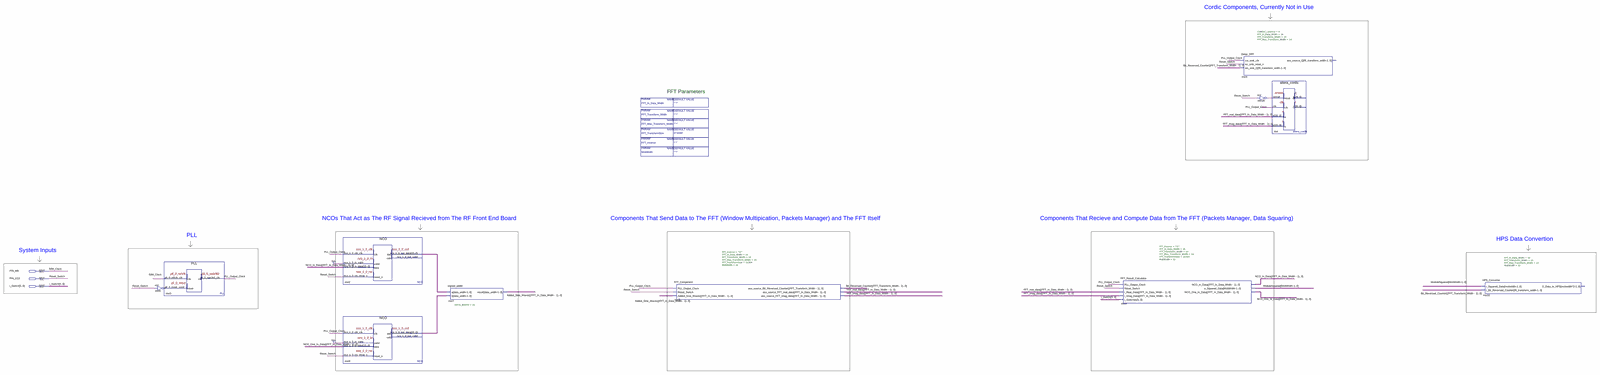
[diagram p0: schematic sheet, whole]
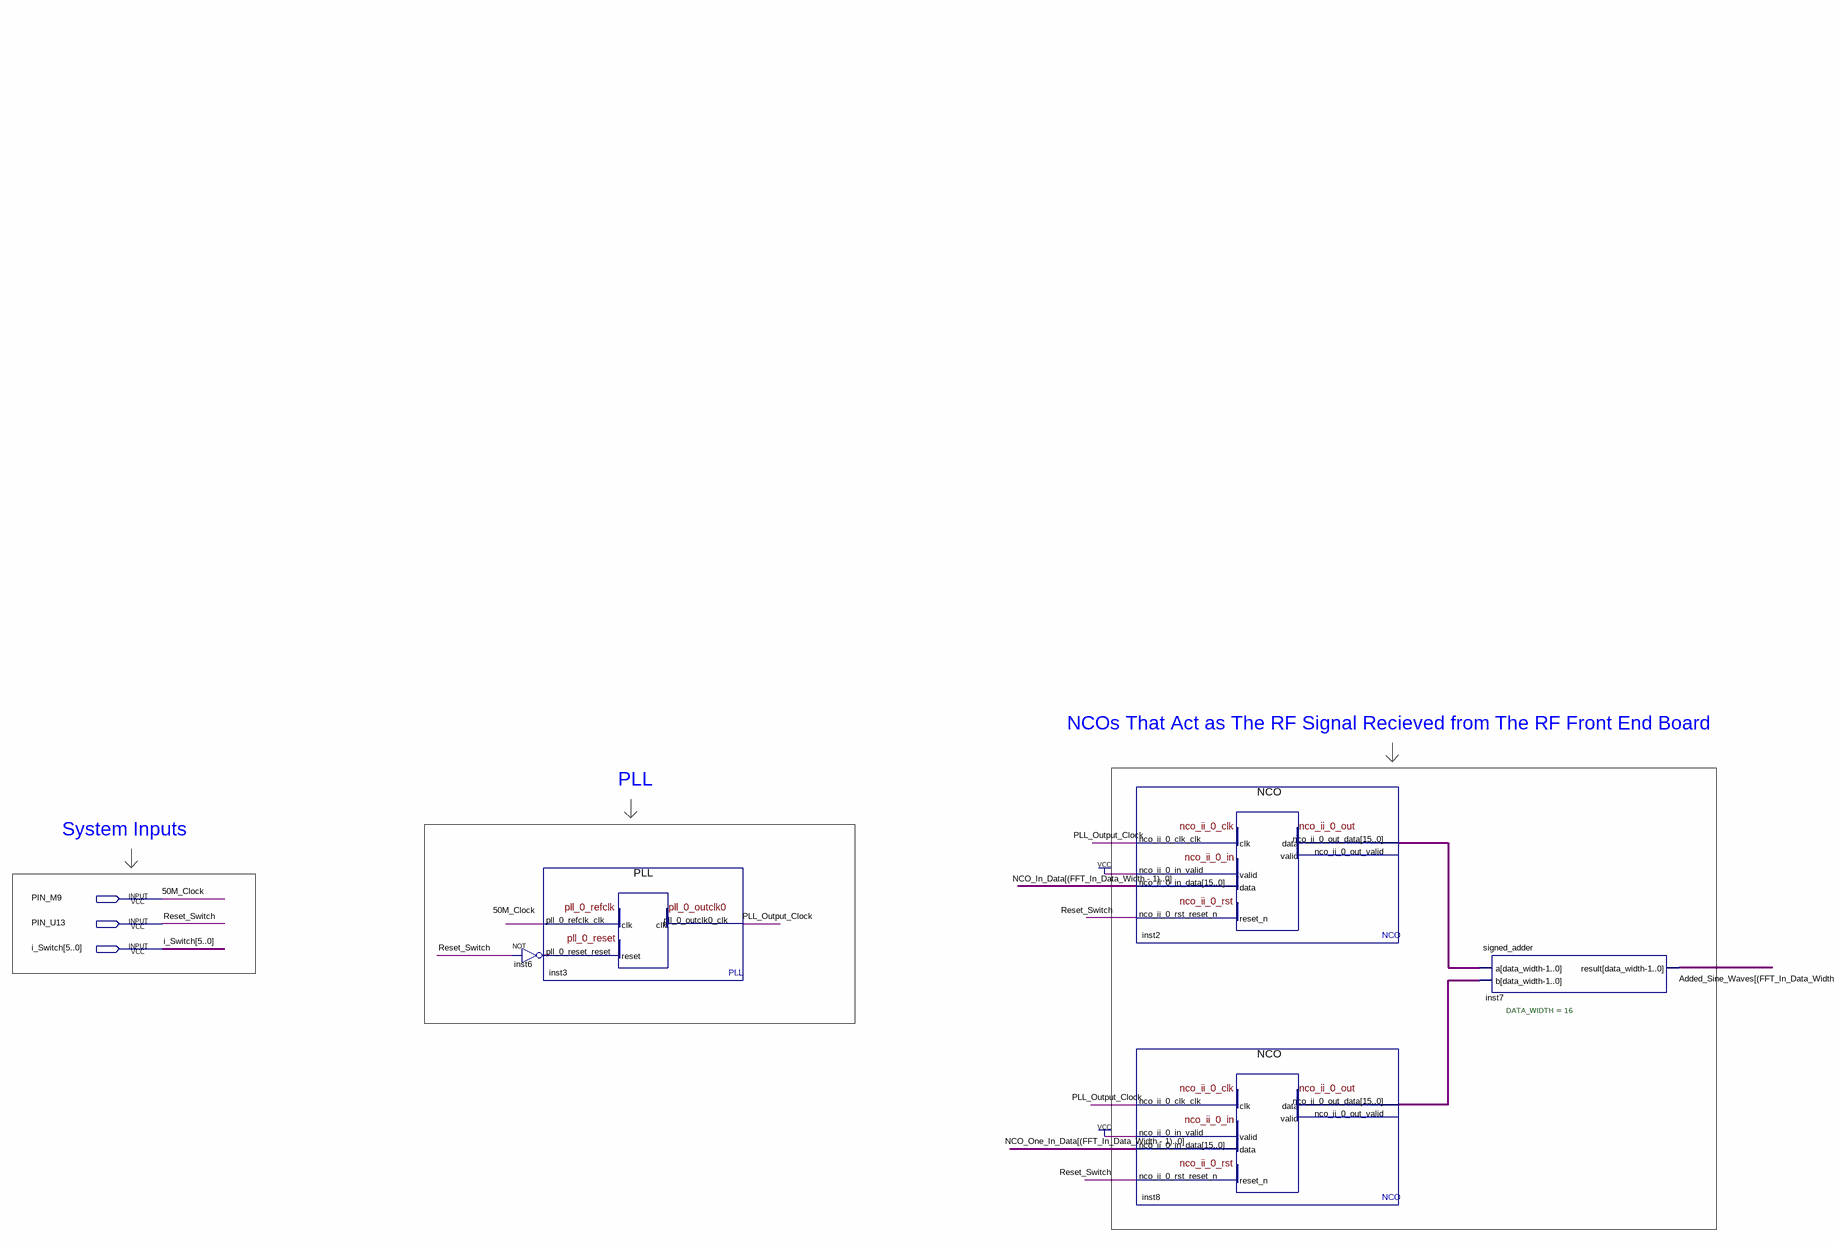
[diagram p1: schematic sheet, left part]
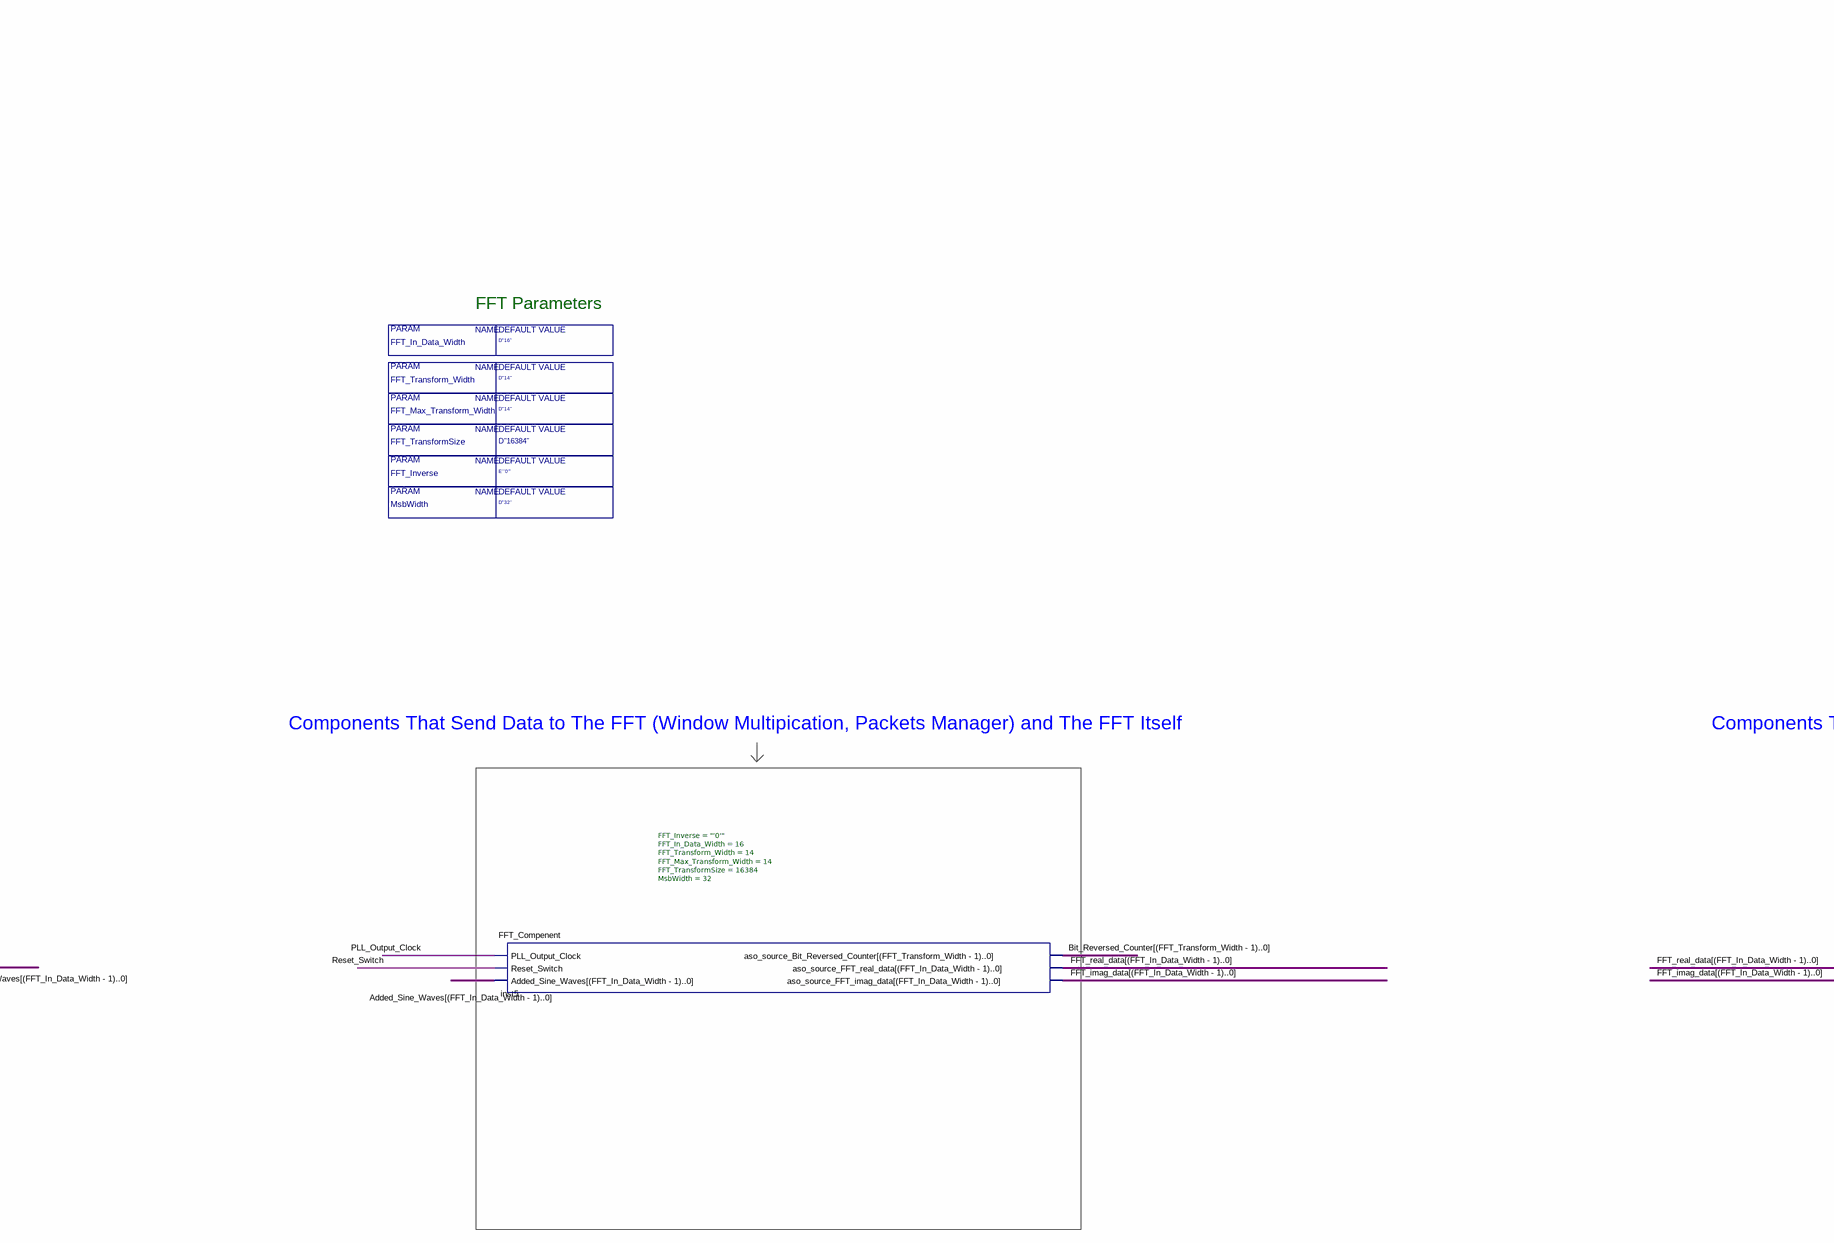
[diagram p2: schematic sheet, centre part]
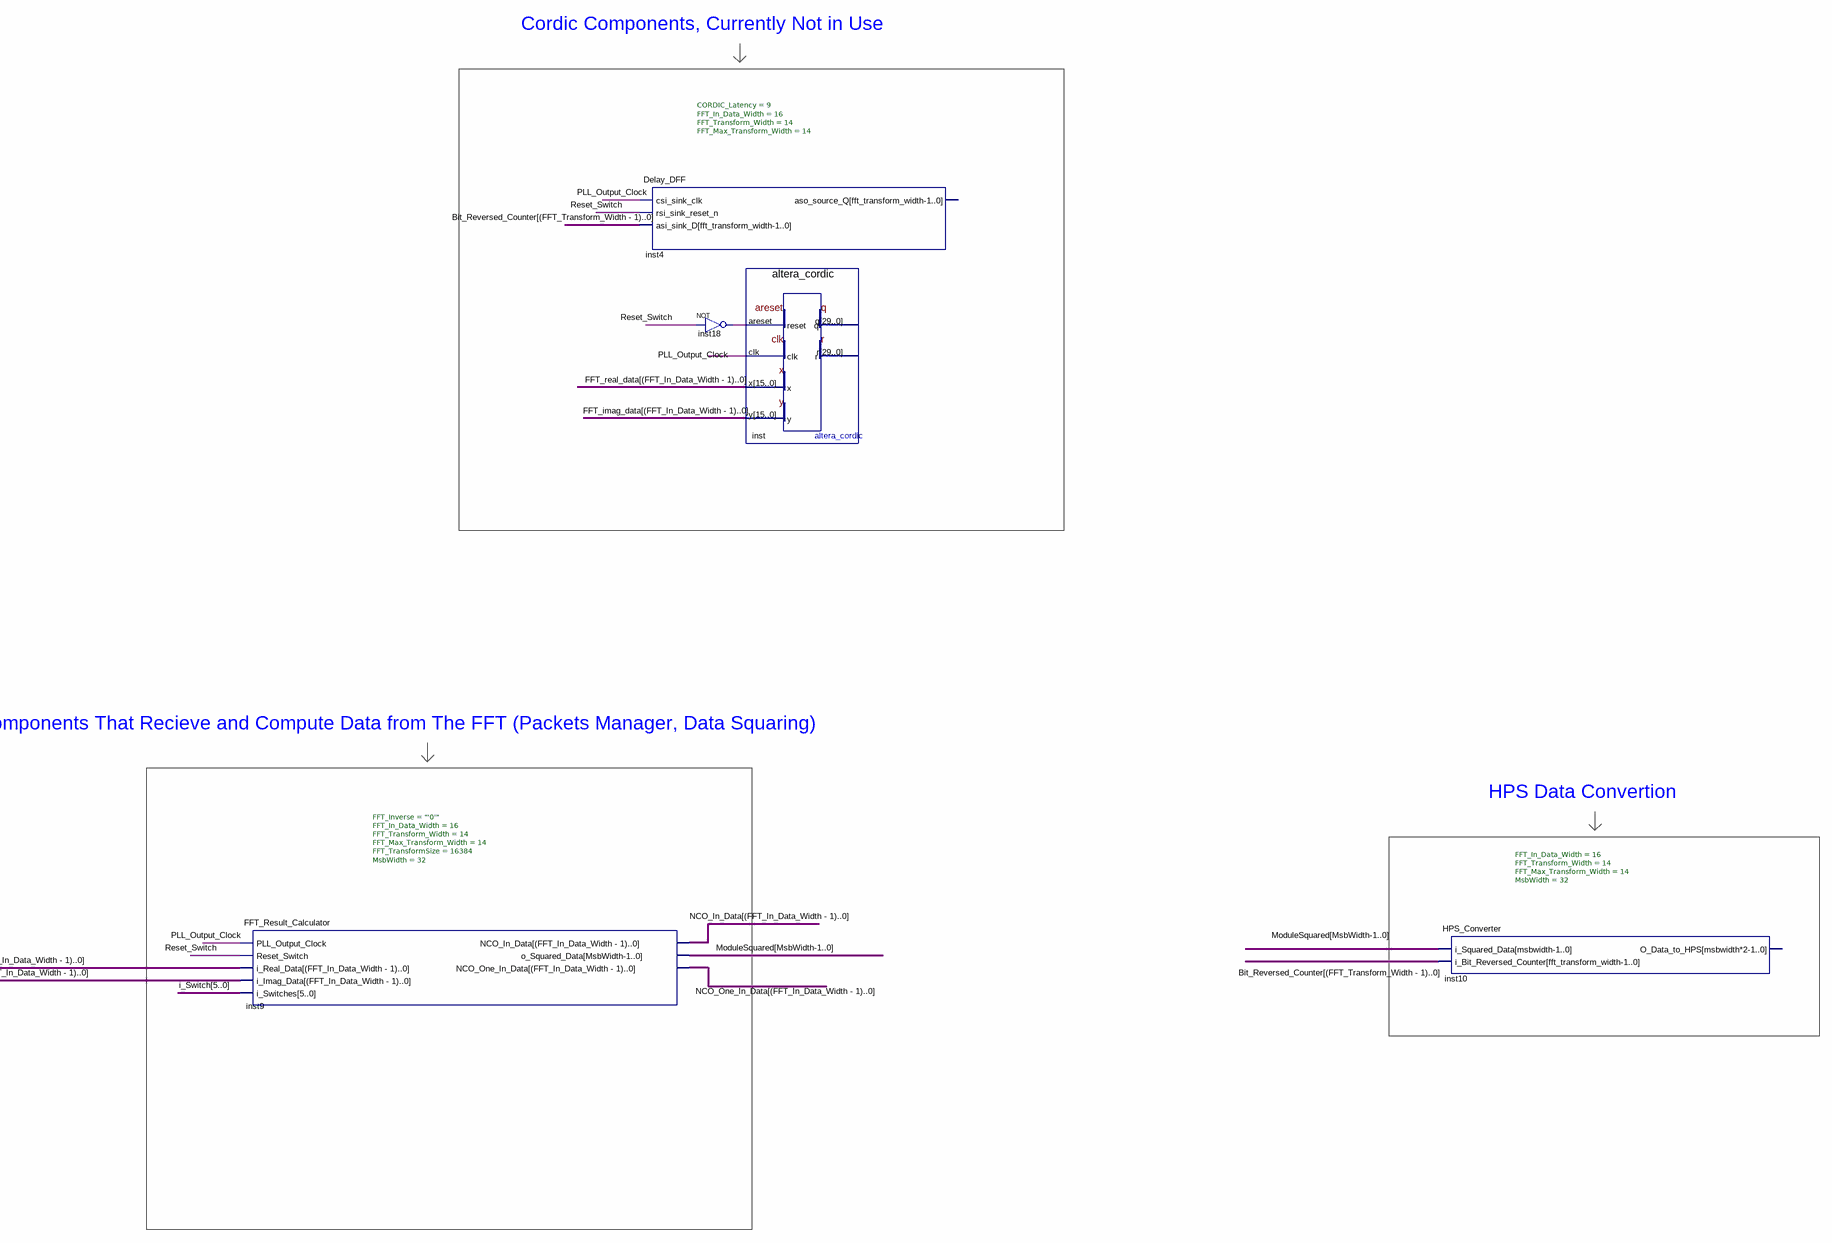
[diagram p3: schematic sheet, right part]
// Quartus schematic Multiple_NCO.bdf as structural Verilog: 11 symbols, 3 pins
module Multiple_NCO #(parameter FFT_Inverse = "E\"'0'\"", parameter FFT_In_Data_Width = "D\"16\"", parameter FFT_Transform_Width = "D\"14\"", parameter FFT_Max_Transform_Width = "D\"14\"", parameter FFT_TransformSize = "D\"16384\"", parameter MsbWidth = "D\"32\"") (
  input  PIN_M9,
  input  PIN_U13,
  input  [5:0] i_Switch
);

  wire \Added_Sine_Waves[(FFT_In_Data_Width_-_1)..0] , \Bit_Reversed_Counter[(FFT_Transform_Width_-_1)..0] ,
       \FFT_imag_data[(FFT_In_Data_Width_-_1)..0] , \FFT_real_data[(FFT_In_Data_Width_-_1)..0] , inst6_out,
       inst18_out, \ModuleSquared[MsbWidth-1..0] , \NCO_In_Data[(FFT_In_Data_Width_-_1)..0] ,
       \NCO_One_In_Data[(FFT_In_Data_Width_-_1)..0] , PLL_Output_Clock;
  wire [15:0] inst2_nco_ii_0_out_data, inst8_nco_ii_0_out_data;

  not inst6 (inst6_out, PIN_U13);
  PLL inst3 (.pll_0_refclk_clk(PIN_M9), .pll_0_reset_reset(inst6_out), .pll_0_outclk0_clk(PLL_Output_Clock));
  NCO inst2 (
    .nco_ii_0_clk_clk(PLL_Output_Clock), .nco_ii_0_in_valid(1'b1),
    .nco_ii_0_in_data({16{\NCO_In_Data[(FFT_In_Data_Width_-_1)..0] }}), .nco_ii_0_rst_reset_n(PIN_U13),
    .nco_ii_0_out_data(inst2_nco_ii_0_out_data));  // open: nco_ii_0_out_valid
  NCO inst8 (
    .nco_ii_0_clk_clk(PLL_Output_Clock), .nco_ii_0_in_valid(1'b1),
    .nco_ii_0_in_data({16{\NCO_One_In_Data[(FFT_In_Data_Width_-_1)..0] }}), .nco_ii_0_rst_reset_n(PIN_U13),
    .nco_ii_0_out_data(inst8_nco_ii_0_out_data));  // open: nco_ii_0_out_valid
  signed_adder #(.DATA_WIDTH(16)) inst7 (
    .a(inst2_nco_ii_0_out_data), .b(inst8_nco_ii_0_out_data),
    .result(\Added_Sine_Waves[(FFT_In_Data_Width_-_1)..0] ));
  FFT_Compenent #(.FFT_Inverse("'0'"), .FFT_In_Data_Width(16), .FFT_Transform_Width(14), .FFT_Max_Transform_Width(14), .FFT_TransformSize(16384), .MsbWidth(32)) inst5 (
    .PLL_Output_Clock(PLL_Output_Clock), .Reset_Switch(PIN_U13),
    .Added_Sine_Waves({16{\Added_Sine_Waves[(FFT_In_Data_Width_-_1)..0] }}),
    .aso_source_Bit_Reversed_Counter(\Bit_Reversed_Counter[(FFT_Transform_Width_-_1)..0] ),
    .aso_source_FFT_real_data(\FFT_real_data[(FFT_In_Data_Width_-_1)..0] ),
    .aso_source_FFT_imag_data(\FFT_imag_data[(FFT_In_Data_Width_-_1)..0] ));
  FFT_Result_Calculator #(.FFT_Inverse("'0'"), .FFT_In_Data_Width(16), .FFT_Transform_Width(14), .FFT_Max_Transform_Width(14), .FFT_TransformSize(16384), .MsbWidth(32)) inst9 (
    .PLL_Output_Clock(PLL_Output_Clock), .Reset_Switch(PIN_U13),
    .i_Real_Data({16{\FFT_real_data[(FFT_In_Data_Width_-_1)..0] }}),
    .i_Imag_Data({16{\FFT_imag_data[(FFT_In_Data_Width_-_1)..0] }}), .i_Switches(i_Switch),
    .NCO_In_Data(\NCO_In_Data[(FFT_In_Data_Width_-_1)..0] ), .o_Squared_Data(\ModuleSquared[MsbWidth-1..0] ),
    .NCO_One_In_Data(\NCO_One_In_Data[(FFT_In_Data_Width_-_1)..0] ));
  Delay_DFF #(.CORDIC_Latency(9), .FFT_In_Data_Width(16), .FFT_Transform_Width(14), .FFT_Max_Transform_Width(14)) inst4 (
    .csi_sink_clk(PLL_Output_Clock), .rsi_sink_reset_n(PIN_U13),
    .asi_sink_D({14{\Bit_Reversed_Counter[(FFT_Transform_Width_-_1)..0] }}));  // open: aso_source_Q
  not inst18 (inst18_out, PIN_U13);
  altera_cordic inst (
    .areset(inst18_out), .clk(PLL_Output_Clock), .x({16{\FFT_real_data[(FFT_In_Data_Width_-_1)..0] }}),
    .y({16{\FFT_imag_data[(FFT_In_Data_Width_-_1)..0] }}));  // open: q, r
  HPS_Converter #(.FFT_In_Data_Width(16), .FFT_Transform_Width(14), .FFT_Max_Transform_Width(14), .MsbWidth(32)) inst10 (
    .i_Squared_Data({32{\ModuleSquared[MsbWidth-1..0] }}),
    .i_Bit_Reversed_Counter({14{\Bit_Reversed_Counter[(FFT_Transform_Width_-_1)..0] }}));  // open: O_Data_to_HPS

  // Other names for the same wires on the sheet: 50M_Clock = PIN_M9; Reset_Switch = PIN_U13

  // Notes on the sheet:
  //   Cordic Components, Currently Not in Use           
  //   FFT Parameters
  //   NCOs That Act as The RF Signal Recieved from The RF Front End Board       
  //   Components That Send Data to The FFT (Window Multipication, Packets Manager) and The FFT Itself          
  //   Components That Recieve and Compute Data from The FFT (Packets Manager, Data Squaring)          
  //   PLL
  //   HPS Data Convertion   
  //   System Inputs   
endmodule
